# EAGLE design trabalho (EAGLE 9.6.2)
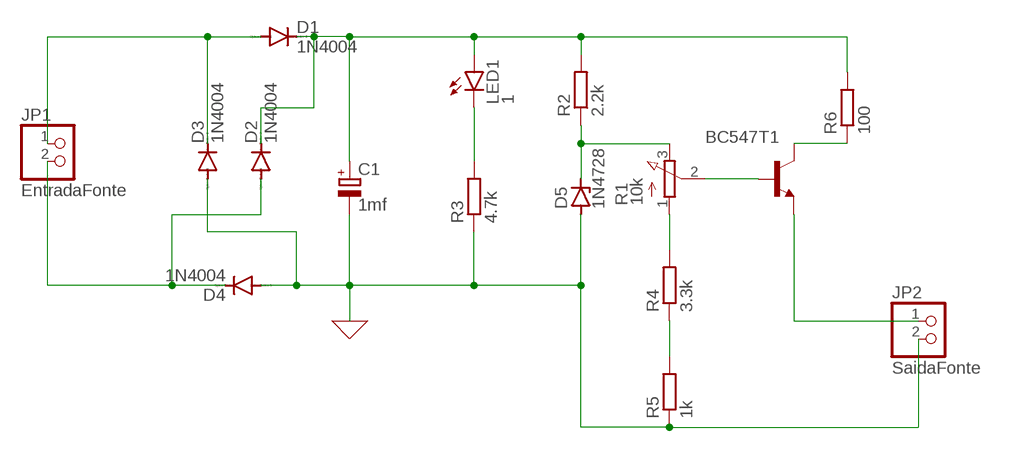
[diagram p0: schematic, sheet 1]

## Parts
C1  1mf  CPOL-EUE5-10.5  [E5-10,5]
D1  1N4004  [DO41-10]
D2  1N4004  [DO41-10]
D3  1N4004  [DO41-10]
D4  1N4004  [DO41-10]
D5  1N4728  [DO41Z10]
JP1  EntradaFonte  PINHD-1X2  [1X02]
JP2  SaidaFonte  PINHD-1X2  [1X02]
LED1  1  LED5MM  [LED5MM]
R1  10k  3RP/1610N  [3RP/1610N]
R2  2.2k  R-EU_0207/10  [0207/10]
R3  4.7k  R-EU_0207/10  [0207/10]
R4  3.3k  R-EU_0207/10  [0207/10]
R5  1k  R-EU_0207/10  [0207/10]
R6  100  R-EU_0207/10  [0207/10]
T1  BC547  [TO92]

## Nets
0: C1.- D3.A D4.A D5.A JP2.2 R3.1 R5.1 ; supply symbol labelled GND
N$1: C1.+ D1.C D2.C LED1.A R2.2 R6.2
N$2: LED1.K(C) R3.2
N$3: D5.C R1.3(E) R2.1
N$4: R1.1(A) R4.2
N$5: R4.1 R5.2
N$7: R1.2(S) T1.2(B)
N$8: R6.1 T1.3(C)
N$9: JP2.1 T1.1(E)
N$10: D1.A D3.C JP1.1
N$11: D2.A D4.C JP1.2

## Library data of the parts
C1 = rcl:CPOL-EU: POLARIZED CAPACITOR, European symbol; SPICEPREFIX: C
D1-D4 = diode:1N4004: DIODE general purpose rectifier, 1 A
D5 = diode:1N4728: Z DIODE 3.3 V, 1W, 5 percent
JP1 JP2 = pinhead:PINHD-1X2: PIN HEADER
LED1 = led:LED: LED OSRAM: - CHIPLED LG R971, LG N971, LY N971, LG Q971, LY Q971, LO R971, LY R971 LH N974, LH R974 LS Q976, LO Q976, LY Q976 LO Q996 - Hyper CHIPLED LW Q18S LB Q993, LB Q99A, LB R99A - SideLED LS A670, LO A670, LY A670, LG A670, LP A670 LB A673, LV A673, LT A673, LW A673 LH A674 LY A675 LS A676, LA A676, LO A676, LY A676, LW A676 LS A679, LY A679, LG A679 - Hyper Micro SIDELED® LS Y876, LA Y876, LO Y876, LY Y876 LT Y87S - SmartLED LW L88C, LW L88S LB L89C, LB L89S, LG L890 LS L89K, LO L89K, LY L89K LS L896, LA L896, LO L896, LY L896 - TOPLED LS T670, LO T670, LY T670, LG T670, LP T670 LSG T670, LSP T670, LSY T670, LOP T670, LYG T670 LG T671, LOG T671, LSG T671 LB T673, LV T673, LT T673, LW T673 LH T674 LS T676, LA T676, LO T676, LY T676, LB T676, LH T676, LSB T676, LW T676 LB T67C, LV T67C, LT T67C, LS T67K, LO T67K, LY T67K, LW E67C LS E67B, LA E67B, LO E67B, LY E67B, LB E67C, LV E67C, LT E67C LW T67C LS T679, LY T679, LG T679 LS T770, LO T770, LY T770, LG T770, LP T770 LB T773, LV T773, LT T773, LW T773 LH T774 LS E675, LA E675, LY E675, LS T675 LS T776, LA T776, LO T776, LY T776, LB T776 LHGB T686 LT T68C, LB T68C - Hyper Mini TOPLED® LB M676 - Mini TOPLED Santana® LG M470 LS M47K, LO M47K, LY M47K Source: http://www.osram.convergy.de LUXEON: - LUMILED® LXK2-PW12-R00, LXK2-PW12-S00, LXK2-PW14-U00, LXK2-PW14-V00 LXK2-PM12-R00, LXK2-PM12-S00, LXK2-PM14-U00 LXK2-PE12-Q00, LXK2-PE12-R00, LXK2-PE12-S00, LXK2-PE14-T00, LXK2-PE14-U00 LXK2-PB12-K00, LXK2-PB12-L00, LXK2-PB12-M00, LXK2-PB14-N00, LXK2-PB14-P00, LXK2-PB14-Q00 LXK2-PR12-L00, LXK2-PR12-M00, LXK2-PR14-Q00, LXK2-PR14-R00 LXK2-PD12-Q00, LXK2-PD12-R00, LXK2-PD12-S00 LXK2-PH12-R00, LXK2-PH12-S00 LXK2-PL12-P00, LXK2-PL12-Q00, LXK2-PL12-R00 Source: www.luxeon.com KINGBRIGHT: KA-3528ASYC Source: www.kingbright.com
R1 = pot:3RP/1610N: 16mm Potentiometer one level Source: http://www.alphapotentiometers.net/html/16mm_pot_2.html
R2-R6 = rcl:R-EU_: RESISTOR, European symbol; SPICEPREFIX: R
T1 = transistor:BC547: NPN TRANSISTOR

## Board
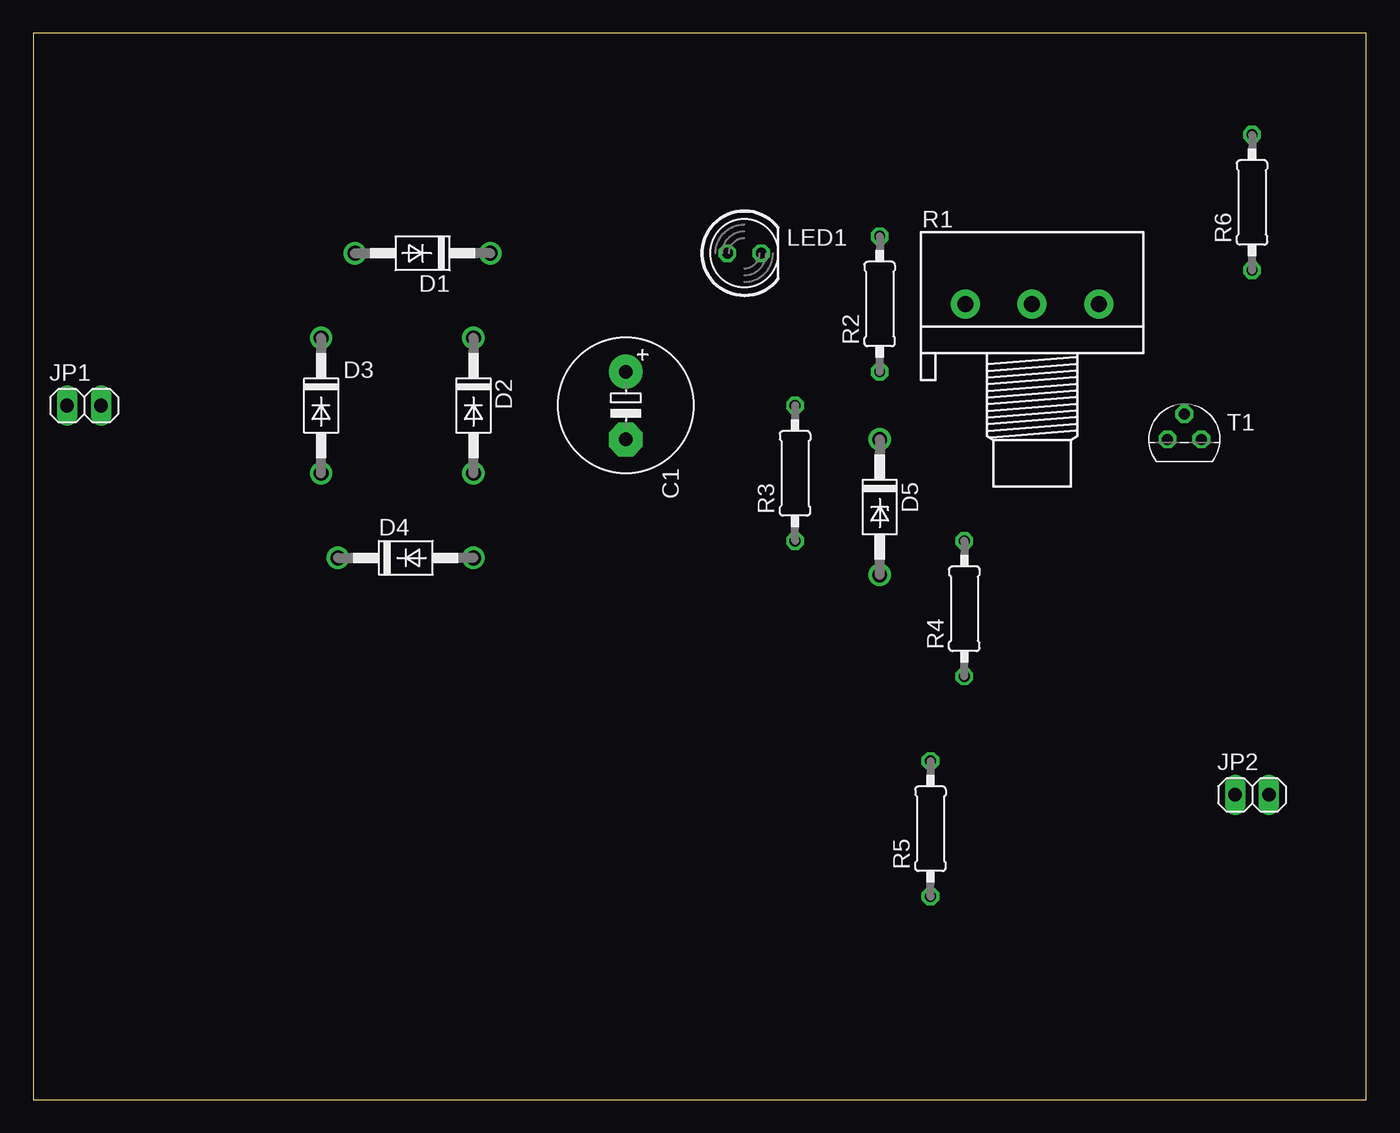
[diagram p1: board, top side]
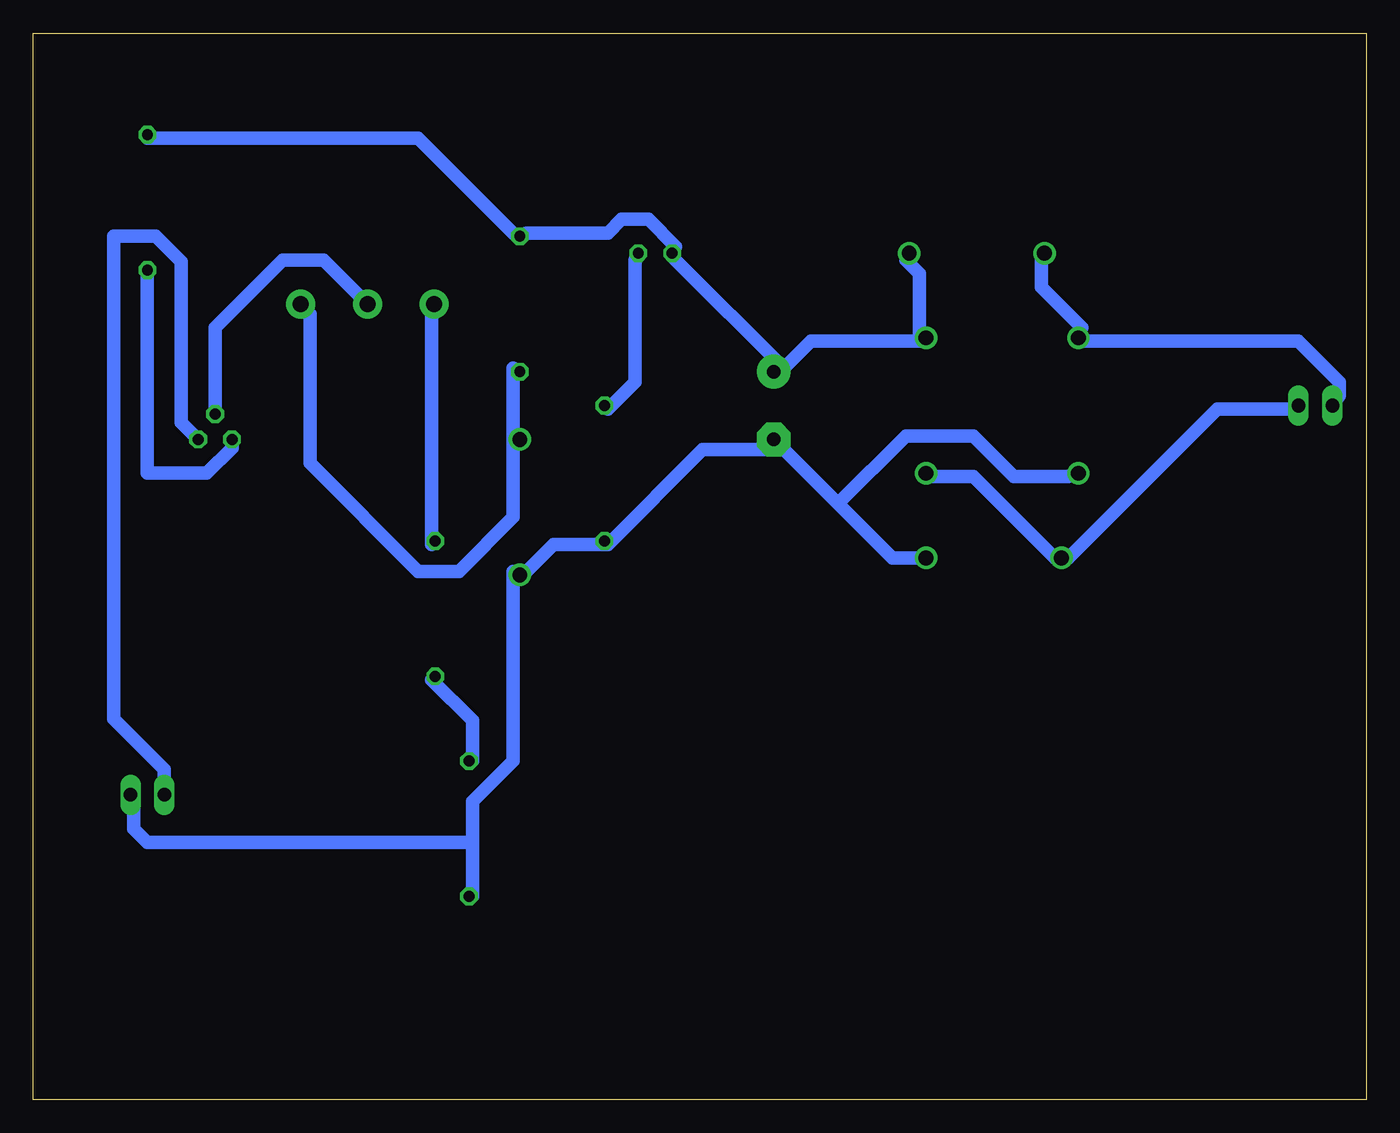
[diagram p2: board, bottom side, seen from below]

Size 100 x 80 mm. Coordinates in mm from the lower left corner, seen from the top.
Outline: 0,0 100,0 100,80 0,80 0,0
Copper layers (1*16): Top 0.035mm / dielectric 1.5mm / Bottom 0.035mm
Design rules "default *": minimum track width 40mil, minimum drill 0.35mm, track to track 40mil, track to pad 40mil, pad to pad 40mil, via to via 40mil, smd to smd 6mil, copper to edge 40mil, drill to drill 6mil, minimum pad ring 10mil, minimum via ring 8mil, stop-mask expansion 4mil, vias tented up to drill 0mil, thermal gap 10mil

### Footprints (pad centres in the part's own frame; a part is rotated, then mirrored left to right if it is on the bottom)
E5-10,5 = drill 1.016 pad 2.54: + -2.54,0 | drill 1.016 pad 2.54 octagon: - 2.54,0
DO41-10 = drill 1.118: A 5.08,0; C -5.08,0
DO41Z10 = drill 1.118: A 5.08,0; C -5.08,0
1X02 = drill 1.016 long: 1 -1.27,0; 2 1.27,0
LED5MM = drill 0.813 octagon: A -1.27,0; K 1.27,0
3RP/1610N = drill 1.2 pad 2.184: 1 -5,0; 2 0,0; 3 5,0
0207/10 = drill 0.813 octagon: 1 -5.08,0; 2 5.08,0
TO92 = drill 0.813 octagon: 1 1.27,0; 2 0,1.905; 3 -1.27,0

### Placement (x,y rotation side)
C1  44.45,52.07 270 top
D1  29.21,63.5 180 top
D2  33.02,52.07 270 top
D3  21.59,52.07 270 top
D4  27.94,40.64 0 top
D5  63.5,44.45 270 top
JP1  3.81,52.07 0 top
JP2  91.44,22.86 0 top
LED1  53.34,63.5 0 top
R1  74.93,59.69 0 top
R2  63.5,59.69 90 top
R3  57.15,46.99 90 top
R4  69.85,36.83 90 top
R5  67.31,20.32 90 top
R6  91.44,67.31 90 top
T1  86.36,49.53 0 top

### Tracks (layer width: path | path; a pad name or v marks a point on that pad's centre or on a via)
0
  Bottom 1.016: D4.A 35.56,40.64 39.62,44.7 | 39.62,44.7 C1.- 44.7,48.77 49.78,48.77 56.9,41.66 | 39.62,44.7 34.54,49.78 29.46,49.78 26.42,46.74 22.35,46.74 D3.A | 67.06,19.3 67.06,22.35 64.01,25.4 64.01,39.62 D5.A 62.99,39.62 60.96,41.66 56.9,41.66 | 67.06,19.3 67.06,15.24 R5.1 | 67.06,19.3 91.44,19.3 92.46,20.32 92.46,22.35 JP2.2 | 56.9,41.66 R3.1
N$1
  Bottom 1.016: 33.53,56.9 33.53,61.98 34.54,62.99 D1.C | 43.69,54.86 51.82,62.99 LED1.A 51.82,64.01 53.85,66.04 55.88,66.04 56.9,65.02 62.99,65.02 R2.2 64.01,65.02 71.12,72.14 91.44,72.14 R6.2 | 33.53,56.9 41.66,56.9 43.69,54.86 | 33.53,56.9 D2.C | 43.69,54.86 C1.+
N$2
  Bottom 1.016: LED1.K 54.86,62.99 54.86,53.85 56.9,51.82 R3.2
N$3
  Bottom 1.016: 64.01,49.78 64.01,54.86 R2.1 | 64.01,49.78 64.01,43.69 68.07,39.62 71.12,39.62 79.25,47.75 79.25,58.93 R1.3 | 64.01,49.78 D5.C
N$4
  Bottom 1.016: R4.2 70.1,41.66 70.1,58.93 R1.1
N$5
  Bottom 1.016: R5.2 67.06,25.4 67.06,28.45 70.1,31.5 R4.1
N$7
  Bottom 1.016: T1.2 86.36,57.91 81.28,62.99 78.23,62.99 R1.2
N$8
  Bottom 1.016: T1.3 85.09,48.9 87,46.99 91.44,46.99 R6.1
N$9
  Bottom 1.016: T1.1 88.9,50.8 88.9,62.87 90.81,64.77 93.98,64.77 93.98,28.57 90.17,24.77 JP2.1
N$10
  Bottom 1.016: JP1.1 2.03,52.83 2.03,53.85 5.08,56.9 21.34,56.9 D3.C 21.34,57.91 24.38,60.96 24.38,62.99 D1.A
N$11
  Bottom 1.016: JP1.2 5.08,51.82 11.18,51.82 22.35,40.64 D4.C 23.37,40.64 29.46,46.74 32.51,46.74 D2.A